# EAGLE schematic TestFanTachoPulseIn (EAGLE 6.1)
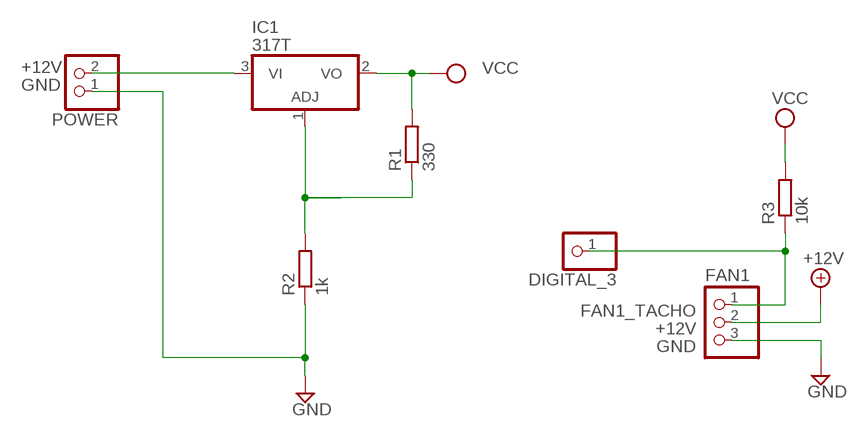
[diagram p0: schematic, sheet 1]

## Parts
DIGITAL_3  PINHD-1X1  [1X01]
FAN1  PINHD-1X3  [1X03]
IC1  317T  [TO220H]
POWER  PINHD-1X2  [1X02]
R1  330  R-EU_0207/2V  [0207/2V]
R2  1k  R-EU_0207/12  [0207/12]
R3  10k  R-EU_0207/7  [0207/7]

## Nets
+12V: FAN1.2 IC1.3(VI) POWER.2
FAN1_TACHO: DIGITAL_3.1 FAN1.1 R3.1
GND: FAN1.3 POWER.1 R2.1
N$1: IC1.1(ADJ) R1.1 R2.2
VCC: IC1.2(VO) R1.2 R3.2

## Library data of the parts
DIGITAL_3 = pinhead:PINHD-1X1: PIN HEADER
FAN1 = pinhead:PINHD-1X3: PIN HEADER
IC1 = Rodentometer:*317: Positive VOLTAGE REGULATOR
POWER = Rodentometer:PINHD-1X2: PIN HEADER
R1 = EnigmaMon:R-EU_: RESISTOR, European symbol
R2 R3 = rcl:R-EU_: RESISTOR, European symbol